# EAGLE schematic Modul PCB (bordered) (EAGLE 9.6.2)
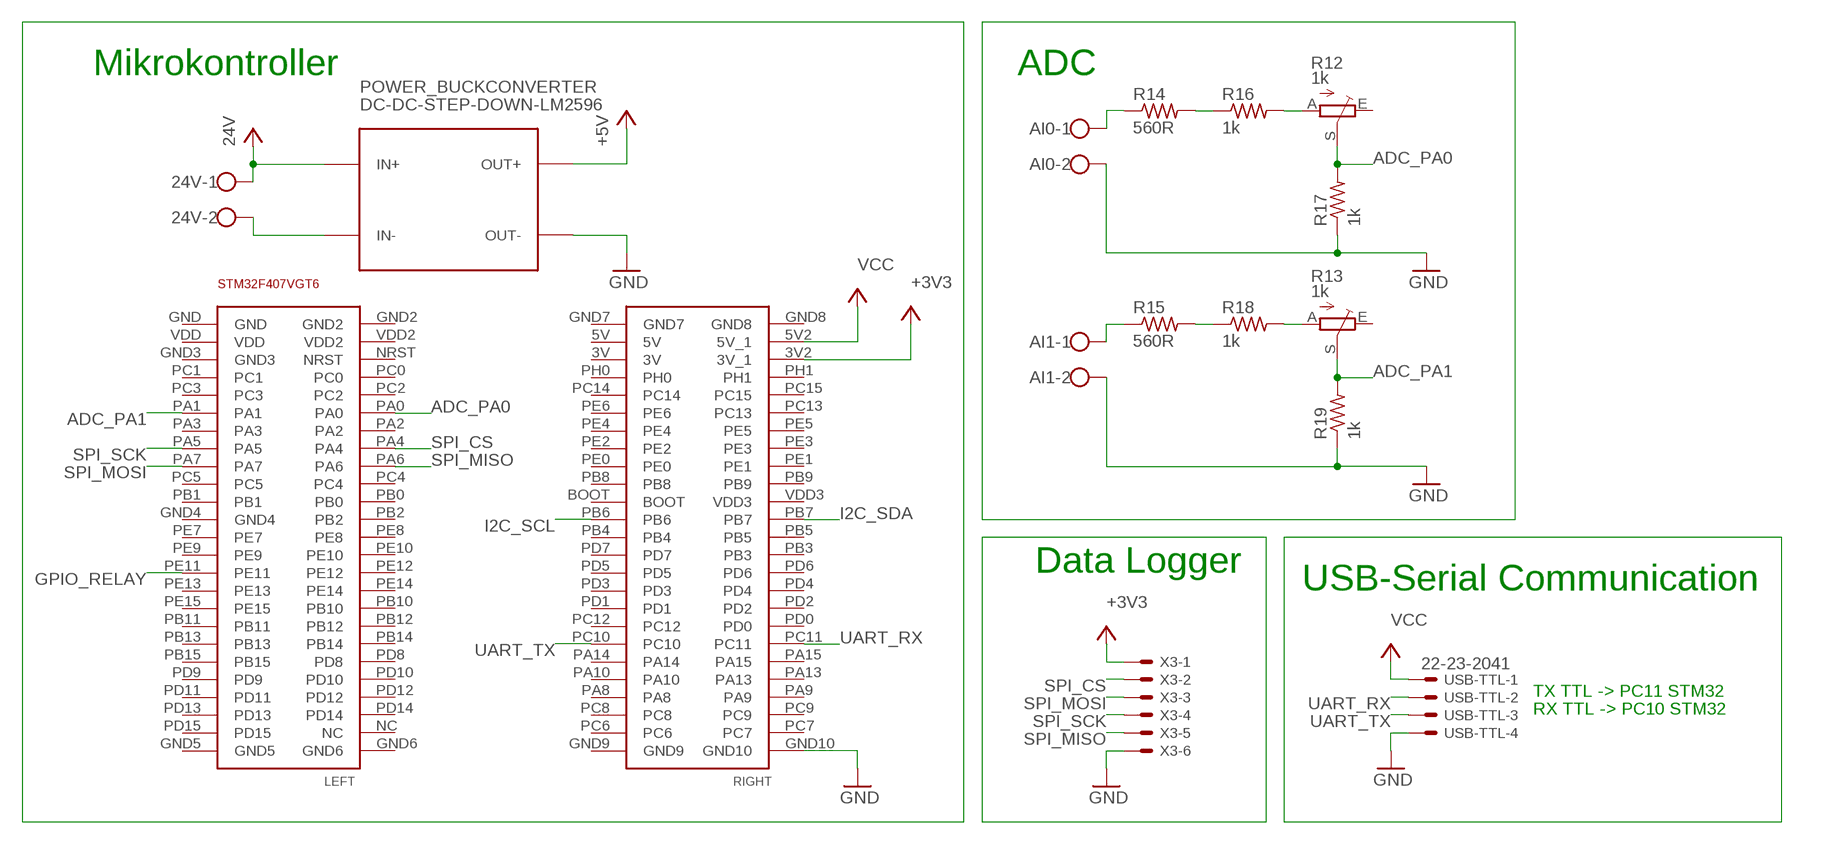
[diagram p0: schematic, sheet 1, part 1 of 2]
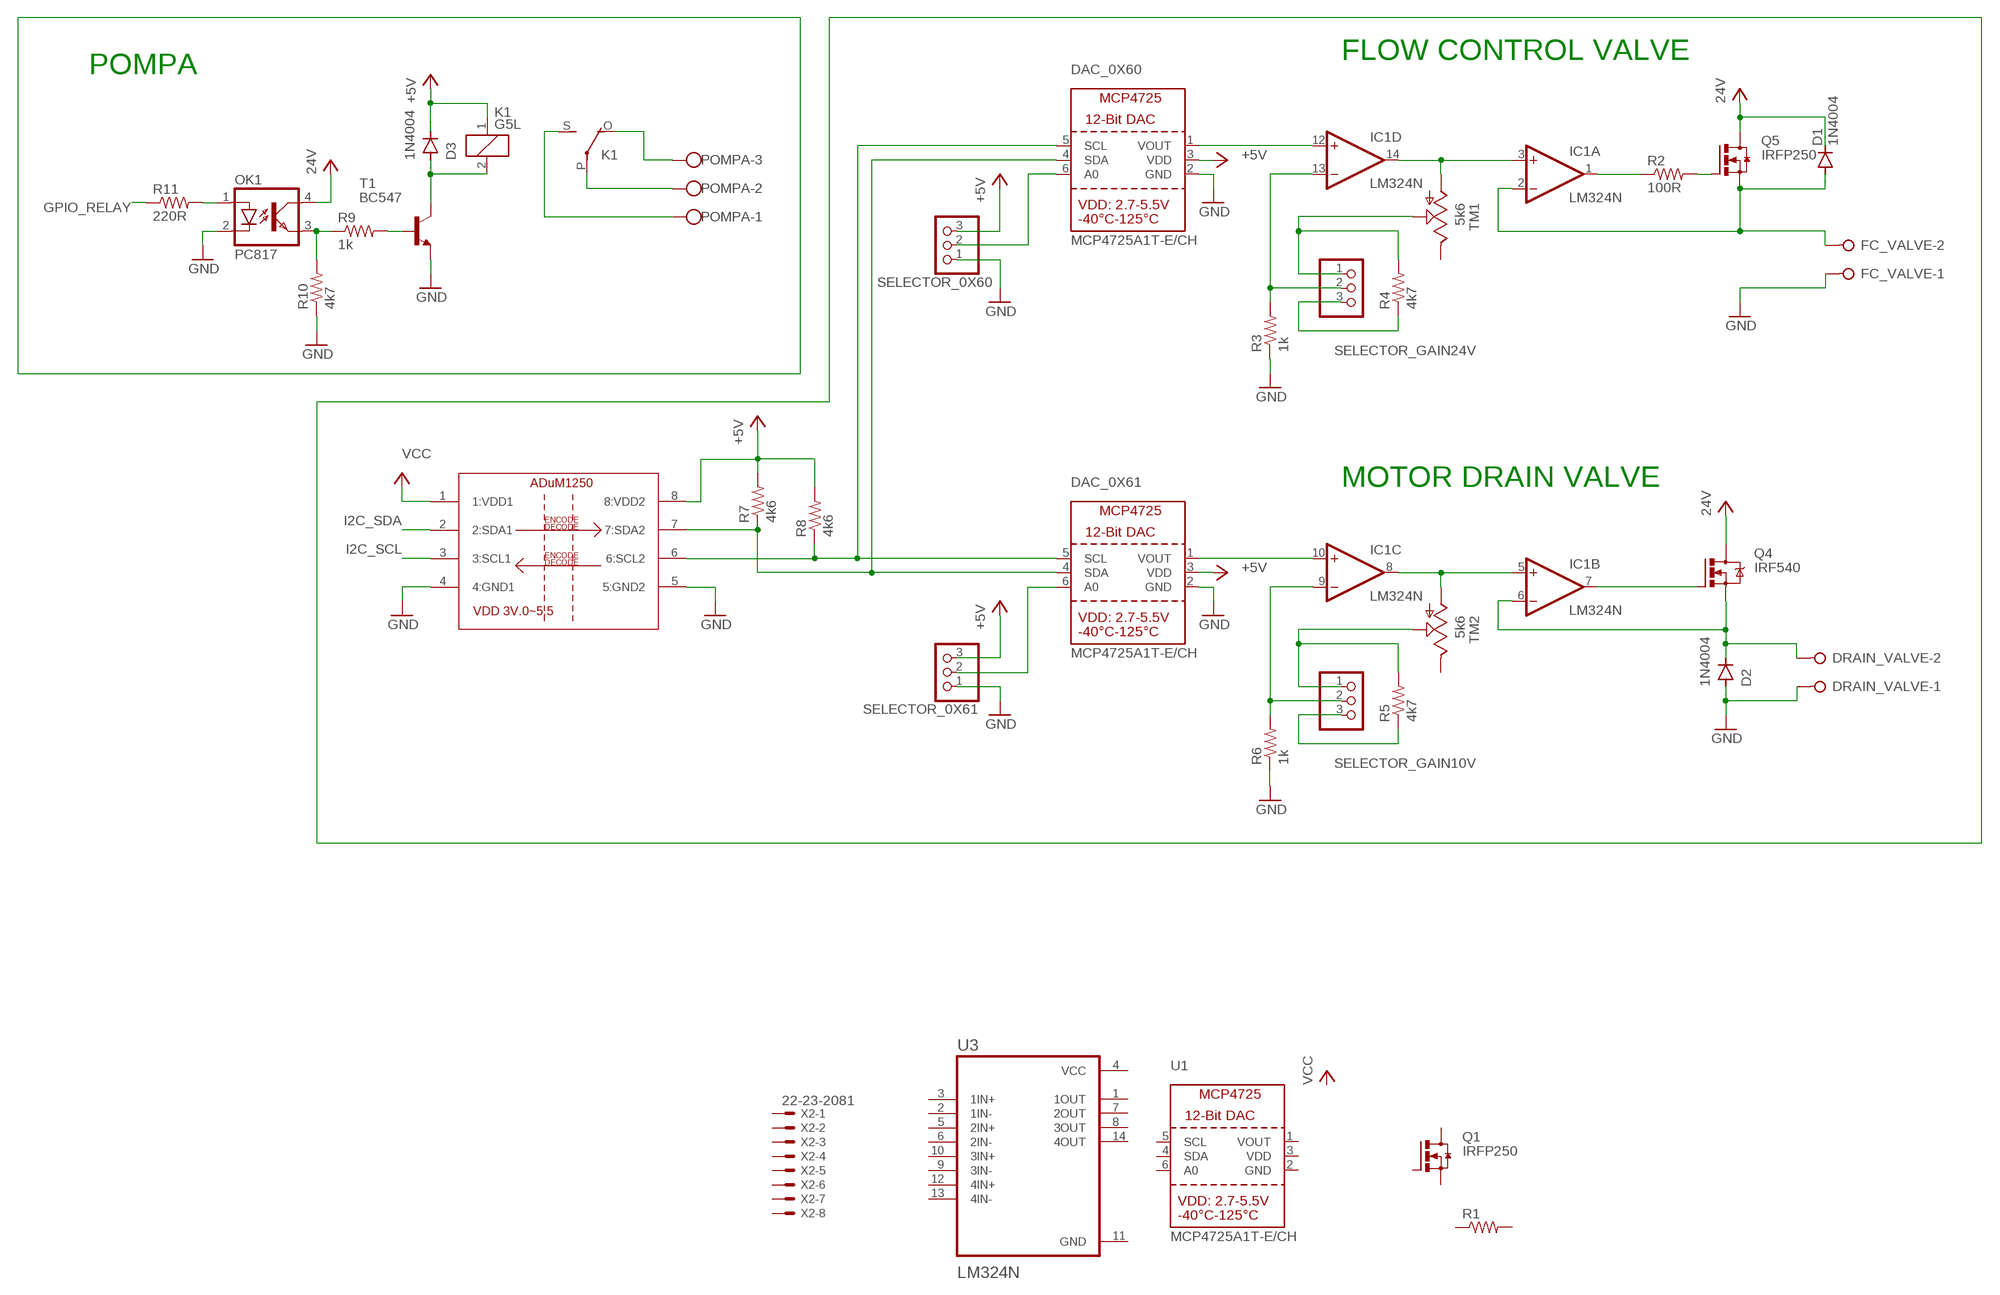
[diagram p1: schematic, sheet 1, part 2 of 2]

## Parts
24V  W237-102  [W237-102]
AI0  W237-102  [W237-102]
AI1  W237-102  [W237-102]
D1  1N4004  [DO41-10]
D2  1N4004  [DO41-10]
D3  1N4004  [DO41-10]
DAC_0X60  MCP4725A1T-E/CH  DAC_MCP4725  [SOT23-6]
DAC_0X61  MCP4725A1T-E/CH  DAC_MCP4725  [SOT23-6]
DRAIN_VALVE  W237-02P  [W237-132]
FC_VALVE  W237-02P  [W237-132]
IC1  LM324N  [DIL14]
K1  G5L  [G5LE]
OK1  PC817  [DIL04]
POMPA  W237-103  [W237-103]
POWER_BUCKCONVERTER  DC-DC-STEP-DOWN-LM2596  [DC-DC-STEP-DOWN-LM2596]
Q1  IRFP250  [TO-247AD-V]
Q4  IRF540  [TO220BV]
Q5  IRFP250  [TO-247AD-V]
R1  R-US_0207/10  [0207/10]
R2  100R  R-US_0207/10  [0207/10]
R3  1k  R-US_0207/10  [0207/10]
R4  4k7  R-US_0207/10  [0207/10]
R5  4k7  R-US_0207/10  [0207/10]
R6  1k  R-US_0207/10  [0207/10]
R7  4k6  R-US_0207/10  [0207/10]
R8  4k6  R-US_0207/10  [0207/10]
R9  1k  R-US_0207/10  [0207/10]
R10  4k7  R-US_0207/10  [0207/10]
R11  220R  R-US_0207/10  [0207/10]
R12  1k  TRIM_EU-RJ9W  [RJ9W]
R13  1k  TRIM_EU-RJ9W  [RJ9W]
R14  560R  R-US_0207/10  [0207/10]
R15  560R  R-US_0207/10  [0207/10]
R16  1k  R-US_0207/10  [0207/10]
R17  1k  R-US_0207/10  [0207/10]
R18  1k  R-US_0207/10  [0207/10]
R19  1k  R-US_0207/10  [0207/10]
SELECTOR_0X60  PINHD-1X3  [1X03]
SELECTOR_0X61  PINHD-1X3  [1X03]
SELECTOR_GAIN10V  PINHD-1X3  [1X03]
SELECTOR_GAIN24V  PINHD-1X3  [1X03]
STM32F407VGT6  STM32F4-DISCOVERY  [STM32F407VG]
T1  BC547  [TO92]
TM1  5k6  TRIM  [6MM]
TM2  5k6  TRIM  [6MM]
U1  MCP4725A1T-E/CH  DAC_MCP4725  [SOT23-6]
U3  LM324N  [DIP794W45P254L1969H508Q14]
U$1  ADUM1250  [SOIC_N]
USB-TTL  22-23-2041  [22-23-2041]
X2  22-23-2081  [22-23-2081]
X3  22-23-2061  [22-23-2061]

## Nets
+3V3: STM32F407VGT6.3V2(3V_1) X3.1
+5V: D3.C DAC_0X60.3(VDD) DAC_0X61.3(VDD) K1.1 POWER_BUCKCONVERTER.OUT+ R7.2 R8.2 SELECTOR_0X60.3 SELECTOR_0X61.3 U$1.8(8:VDD2)
ADC_PA0: R12.S R17.2 STM32F407VGT6.PA0
ADC_PA1: R13.S R19.2 STM32F407VGT6.PA1
GND: AI0.2 AI1.2 D2.A DAC_0X60.2(GND) DAC_0X61.2(GND) DRAIN_VALVE.1 FC_VALVE.1 OK1.2(C) POWER_BUCKCONVERTER.OUT- R3.1 R6.1 R10.1 R17.1 R19.1 SELECTOR_0X60.1 SELECTOR_0X61.1 STM32F407VGT6.GND10 T1.1(E) U$1.4(4:GND1) U$1.5(5:GND2) USB-TTL.4 X3.6
GPIO_RELAY: R11.1 STM32F407VGT6.PE11
I2C_SCL: STM32F407VGT6.PB6 U$1.3(3:SCL1)
I2C_SDA: STM32F407VGT6.PB7 U$1.2(2:SDA1)
N$1: IC1.1(A:OUT) R2.1
N$2: D2.C DRAIN_VALVE.2 IC1.6(B:-IN) Q4.S
N$3: IC1.7(B:OUT) Q4.G
N$4: Q5.G R2.2
N$5: IC1.3(A:+IN) IC1.14(D:OUT) TM1.A
N$6: IC1.5(B:+IN) IC1.8(C:OUT) TM2.A
N$7: D1.A FC_VALVE.2 IC1.2(A:-IN) Q5.S
N$8: IC1.13(D:-IN) R3.2 SELECTOR_GAIN24V.2
N$9: R4.1 SELECTOR_GAIN24V.3
N$10: R4.2 SELECTOR_GAIN24V.1 TM1.S
N$11: R5.2 SELECTOR_GAIN10V.1 TM2.S
N$12: IC1.9(C:-IN) R6.2 SELECTOR_GAIN10V.2
N$13: R5.1 SELECTOR_GAIN10V.3
N$14: DAC_0X60.1(VOUT) IC1.12(D:+IN)
N$15: DAC_0X61.1(VOUT) IC1.10(C:+IN)
N$16: R9.2 T1.2(B)
N$17: 24V.2 POWER_BUCKCONVERTER.IN-
N$18: DAC_0X60.6(A0) SELECTOR_0X60.2
N$19: DAC_0X60.4(SDA) DAC_0X61.4(SDA) R7.1 U$1.7(7:SDA2)
N$20: DAC_0X60.5(SCL) DAC_0X61.5(SCL) R8.1 U$1.6(6:SCL2)
N$21: D3.A K1.2 T1.3(C)
N$22: DAC_0X61.6(A0) SELECTOR_0X61.2
N$23: OK1.3(EMIT) R9.1 R10.2
N$24: K1.P(2:P) POMPA.2
N$25: K1.S(2:S) POMPA.1
N$26: K1.O(2:O) POMPA.3
N$27: OK1.1(A) R11.2
N$28: AI0.1 R14.1
N$29: R14.2 R16.1
N$30: R12.A R16.2
N$32: AI1.1 R15.1
N$34: R15.2 R18.1
N$35: R13.A R18.2
SPI_CS: STM32F407VGT6.PA4 X3.2
SPI_MISO: STM32F407VGT6.PA6 X3.5
SPI_MOSI: STM32F407VGT6.PA7 X3.3
SPI_SCK: STM32F407VGT6.PA5 X3.4
UART_RX: STM32F407VGT6.PC11 USB-TTL.2
UART_TX: STM32F407VGT6.PC10 USB-TTL.3
VCC: 24V.1 D1.C OK1.4(COL) POWER_BUCKCONVERTER.IN+ Q4.D Q5.D STM32F407VGT6.5V2(5V_1) U$1.1(1:VDD1) USB-TTL.1 ; supply symbol labelled 24V
Unconnected: Q1.D Q1.G Q1.S R1.1 R1.2 R12.E R13.E STM32F407VGT6.3V STM32F407VGT6.5V STM32F407VGT6.BOOT STM32F407VGT6.GND STM32F407VGT6.GND2 STM32F407VGT6.GND3 STM32F407VGT6.GND4 STM32F407VGT6.GND5 STM32F407VGT6.GND6 STM32F407VGT6.GND7 STM32F407VGT6.GND8 STM32F407VGT6.GND9 STM32F407VGT6.NC STM32F407VGT6.NRST STM32F407VGT6.PA2 STM32F407VGT6.PA3 STM32F407VGT6.PA8 STM32F407VGT6.PA9 STM32F407VGT6.PA10 STM32F407VGT6.PA13 STM32F407VGT6.PA14 STM32F407VGT6.PA15 STM32F407VGT6.PB0 STM32F407VGT6.PB1 STM32F407VGT6.PB2 STM32F407VGT6.PB3 STM32F407VGT6.PB4 STM32F407VGT6.PB5 STM32F407VGT6.PB8 STM32F407VGT6.PB9 STM32F407VGT6.PB10 STM32F407VGT6.PB11 STM32F407VGT6.PB12 STM32F407VGT6.PB13 STM32F407VGT6.PB14 STM32F407VGT6.PB15 STM32F407VGT6.PC0 STM32F407VGT6.PC1 STM32F407VGT6.PC2 STM32F407VGT6.PC3 STM32F407VGT6.PC4 STM32F407VGT6.PC5 STM32F407VGT6.PC6 STM32F407VGT6.PC7 STM32F407VGT6.PC8 STM32F407VGT6.PC9 STM32F407VGT6.PC12 STM32F407VGT6.PC13 STM32F407VGT6.PC14 STM32F407VGT6.PC15 STM32F407VGT6.PD0 STM32F407VGT6.PD1 STM32F407VGT6.PD2 STM32F407VGT6.PD3 STM32F407VGT6.PD4 STM32F407VGT6.PD5 STM32F407VGT6.PD6 STM32F407VGT6.PD7 STM32F407VGT6.PD8 STM32F407VGT6.PD9 STM32F407VGT6.PD10 STM32F407VGT6.PD11 STM32F407VGT6.PD12 STM32F407VGT6.PD13 STM32F407VGT6.PD14 STM32F407VGT6.PD15 STM32F407VGT6.PE0 STM32F407VGT6.PE1 STM32F407VGT6.PE2 STM32F407VGT6.PE3 STM32F407VGT6.PE4 STM32F407VGT6.PE5 STM32F407VGT6.PE6 STM32F407VGT6.PE7 STM32F407VGT6.PE8 STM32F407VGT6.PE9 STM32F407VGT6.PE10 STM32F407VGT6.PE12 STM32F407VGT6.PE13 STM32F407VGT6.PE14 STM32F407VGT6.PE15 STM32F407VGT6.PH0 STM32F407VGT6.PH1 STM32F407VGT6.VDD STM32F407VGT6.VDD2 STM32F407VGT6.VDD3 TM1.E TM2.E U1.1(VOUT) U1.4(SDA) U1.5(SCL) U1.6(A0) U3.1(1OUT) U3.2(1IN-) U3.3(1IN+) U3.5(2IN+) U3.6(2IN-) U3.7(2OUT) U3.8(3OUT) U3.9(3IN-) U3.10(3IN+) U3.12(4IN+) U3.13(4IN-) U3.14(4OUT) X2.1 X2.2 X2.3 X2.4 X2.5 X2.6 X2.7 X2.8

## Notes on the sheet
- FLOW CONTROL VALVE
- POMPA
- Mikrokontroller | ADC
- MOTOR DRAIN VALVE
- Data Logger
- USB-Serial Communication
- TX TTL -> PC11 STM32
- RX TTL -> PC10 STM32

## Power pins joined to a net without a drawn wire
GND: U1.2(GND) U3.11(GND)
V+: IC1.4(P:V+)
V-: IC1.11(P:V-)
VCC: U3.4(VCC)
VDD: U1.3(VDD)

## Library data of the parts
24V AI0 AI1 = con-wago-500:W237-102: WAGO SCREW CLAMP; MPN: 237-102; OC_FARNELL: unknown; OC_NEWARK: 70K9898
D1-D3 = diode:1N4004: DIODE general purpose rectifier, 1 A
DAC_0X60 DAC_0X61 U1 = microbuilder:DAC_MCP4725: MCP4725 - 12-Bit I2C DAC with on-board EEPROM Settling Time: 6 µs 2.7-5.5V Supply 100kHz, 400kHz, 3.4 Mbps I²C EEPROM can be used to store a specific output voltage which will be set coming out of reset I²C Address: 1100 A2 A1 A0 A0 is set via the A0 pin, A2 and A1 are hard-wired on the chip depending on the model chosen: Part Number A2 A1 Code MCP4725A0T-E/CH 0 0 AJNN MCP4725A1T-E/CH 0 1 APNN MCP4725A2T-E/CH 1 0 AQNN MCP4725A3T-E/CH 1 1 ARNN
DRAIN_VALVE FC_VALVE = con-wago-508:W237-02P: WAGO SREW CLAMP; OC_FARNELL: unknown; OC_NEWARK: unknown
IC1 = linear:LM324: OP AMP
K1 = relay:G5L: RELAY 1 x switch, 10 A/120 V AC, 8 A/30 V ADC, Omron; OC_FARNELL: unknown; OC_NEWARK: unknown
OK1 = optocoupler:PC817: SHARP OPTO COUPLER; MPN: PC817X4J000F; OC_FARNELL: 9707727; OC_NEWARK: 97K7059
POMPA = con-wago-500:W237-103: WAGO SCREW CLAMP; MPN: 237-103; OC_FARNELL: unknown; OC_NEWARK: 18M7116
POWER_BUCKCONVERTER = diy-modules:DC-DC-STEP-DOWN-LM2596: DC/DC Step-Down Regulator based on LM2596-ADJ chip LM2596 datasheet available here: http://www.ti.com/lit/ds/symlink/lm2596.pdf Click here to find device on ebay.com <http://www.ebay.com/sch/lm2596+power+regulator>
Q1 Q5 = transistor-power:IRFP25*: 33A/27A, 200V/150V, 0.085/0.012 Ohm, N-Channel Power MOSFET Source: Fairchild Semiconductor Corporation
Q4 = transistor-power:IRF540: HEXFET Power MOSFET
R1-R11 R14-R19 = rcl:R-US_: RESISTOR, American symbol; SPICEPREFIX: R
R12 R13 = pot:TRIM_EU-: POTENTIOMETER
SELECTOR_0X60 SELECTOR_0X61 SELECTOR_GAIN10V SELECTOR_GAIN24V = pinhead:PINHD-1X3: PIN HEADER
STM32F407VGT6 = STM32F4 DISCOVERY:STM32F4-DISCOVERY: STM32F4DISCOVERY STM32F407VG Create by Jairo Reyes Email: jairo.314@hotmail.com
T1 = transistor:BC547: NPN TRANSISTOR
TM1 TM2 = adafruit:TRIM
U3 = LM324N:LM324N: Check availability <https://pricing.snapeda.com/parts/LM324N/STMicroelectronics/view-part?ref=eda>; AVAILABILITY: In Stock; DESCRIPTION: General Purpose Amplifier 4 Circuit - 14-DIP; MF: STMicroelectronics; MP: LM324N; PACKAGE: DIP-14 STMicroelectronics; PRICE: None; PURCHASE-URL: https://pricing.snapeda.com/search/part/LM324N/?ref=eda
U$1 = ADUM1250:ADUM1250
USB-TTL = con-molex:22-23-2041: .100" (2.54mm) Center Header - 4 Pin; MF: MOLEX; MPN: 22-23-2041; OC_FARNELL: 1462920; OC_NEWARK: 38C0355
X2 = con-molex:22-23-2081: .100" (2.54mm) Center Header - 8 Pin; MF: MOLEX; MPN: 22-23-2081; OC_FARNELL: 1756826; OC_NEWARK: 01C7592
X3 = con-molex:22-23-2061: .100" (2.54mm) Center Header - 6 Pin; MF: MOLEX; MPN: 22-23-2061; OC_FARNELL: 1462922; OC_NEWARK: 27C1933